# EAGLE design modules_board (EAGLE 9.6.2)
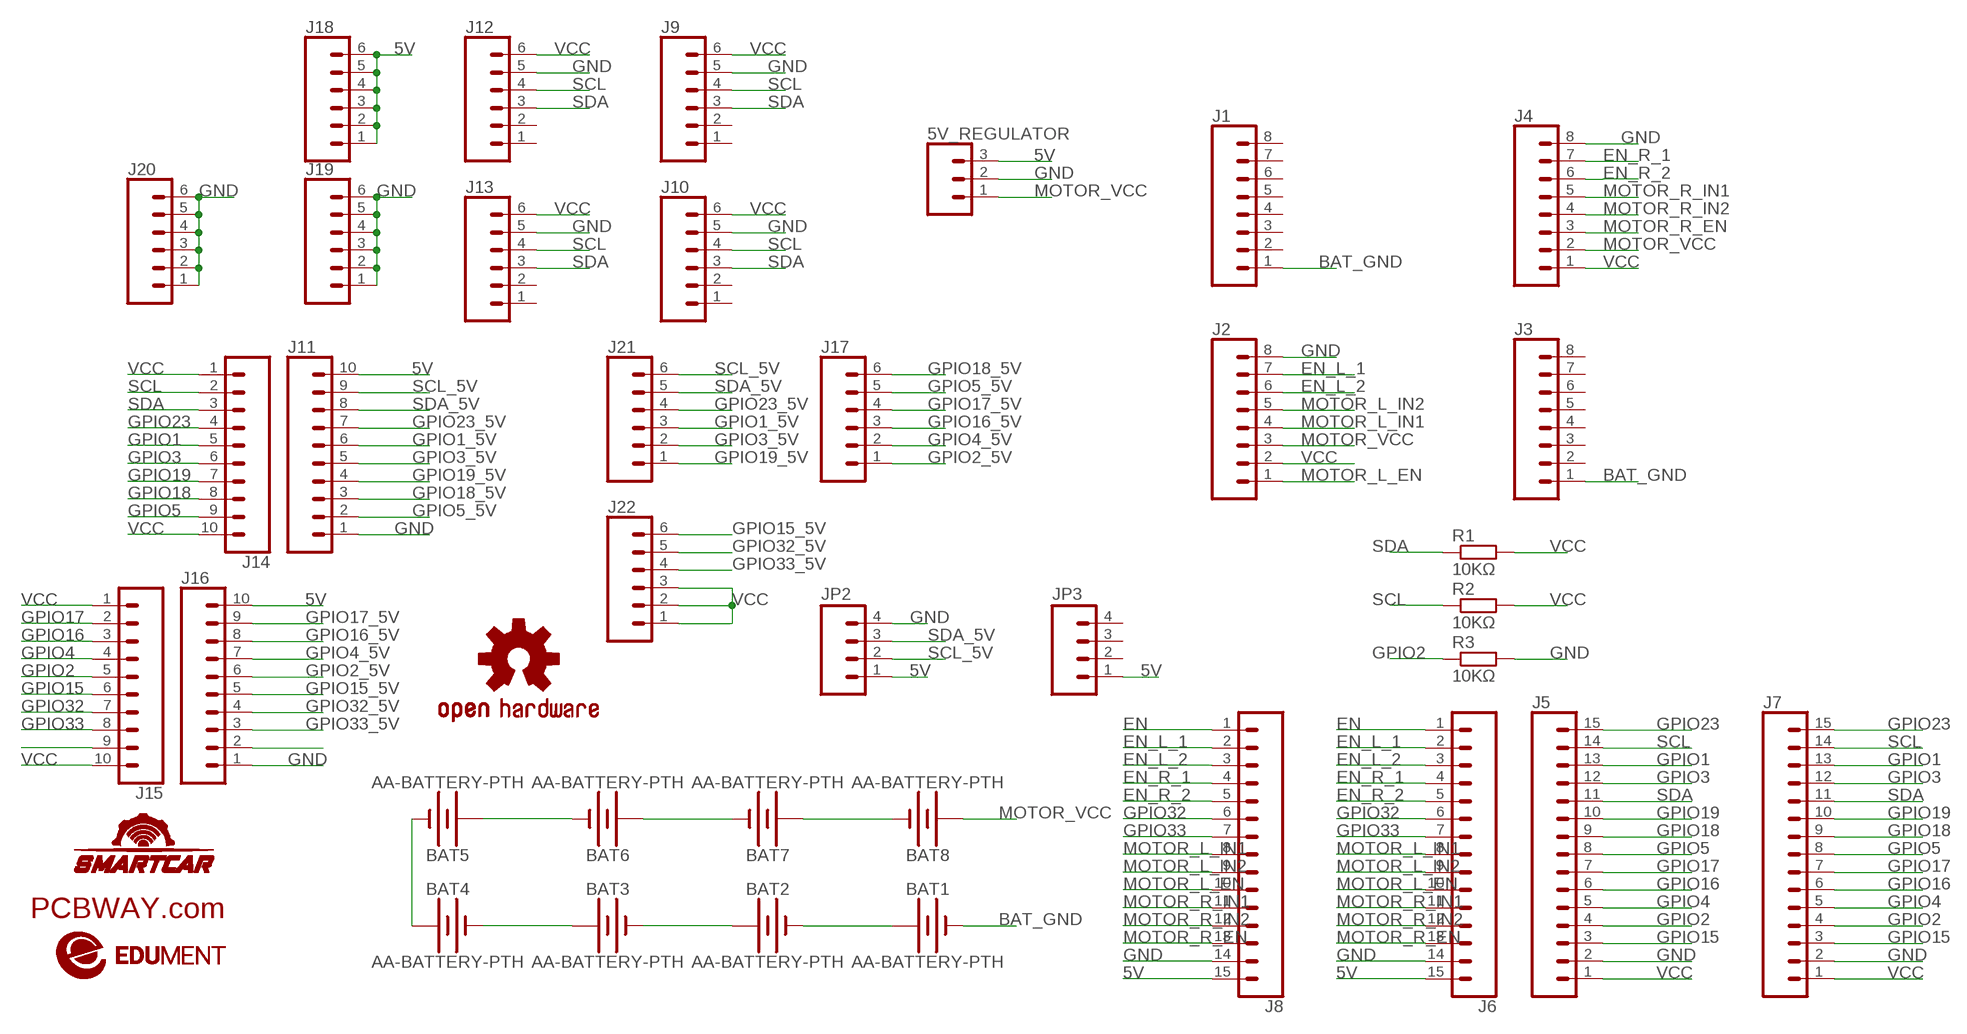
[diagram p0: schematic, sheet 1]

## Parts
5V_REGULATOR  CONN_03LOCK  [1X03_LOCK]
BAT1  AA-BATTERY-PTH  [AA-PCB-BATTERY]
BAT2  AA-BATTERY-PTH  [AA-PCB-BATTERY]
BAT3  AA-BATTERY-PTH  [AA-PCB-BATTERY]
BAT4  AA-BATTERY-PTH  [AA-PCB-BATTERY]
BAT5  AA-BATTERY-PTH  [AA-PCB-BATTERY]
BAT6  AA-BATTERY-PTH  [AA-PCB-BATTERY]
BAT7  AA-BATTERY-PTH  [AA-PCB-BATTERY]
BAT8  AA-BATTERY-PTH  [AA-PCB-BATTERY]
J1  CONN_08NO_SILK_FEMALE_PTH  [1X08_NO_SILK]
J2  CONN_08NO_SILK_FEMALE_PTH  [1X08_NO_SILK]
J3  CONN_08NO_SILK_FEMALE_PTH  [1X08_NO_SILK]
J4  CONN_08NO_SILK_FEMALE_PTH  [1X08_NO_SILK]
J5  CONN_15LOCK_LONGPADS  [1X15_LOCK_LONGPADS]
J6  CONN_15LOCK_LONGPADS  [1X15_LOCK_LONGPADS]
J7  CONN_15LOCK_NO_SILK  [1X15_LOCK_NO_SILK]
J8  CONN_15LOCK_NO_SILK  [1X15_LOCK_NO_SILK]
J9  CONN_06LOCK  [1X06_LOCK]
J10  CONN_06LOCK  [1X06_LOCK]
J11  CONN_10"  [1X10]
J12  CONN_06LOCK  [1X06_LOCK]
J13  CONN_06LOCK  [1X06_LOCK]
J14  CONN_10"  [1X10]
J15  CONN_10"  [1X10]
J16  CONN_10"  [1X10]
J17  CONN_06LOCK  [1X06_LOCK]
J18  CONN_06LOCK  [1X06_LOCK]
J19  CONN_06LOCK  [1X06_LOCK]
J20  CONN_06LOCK  [1X06_LOCK]
J21  CONN_06LOCK  [1X06_LOCK]
J22  CONN_06LOCK  [1X06_LOCK]
JP2  M04NO_SILK_ALL_ROUND  [1X04_NO_SILK_ALL_ROUND]
JP3  M04NO_SILK_ALL_ROUND  [1X04_NO_SILK_ALL_ROUND]
LOGO1  OSHW-LOGOL  [OSHW-LOGO-L]
R1  10KΩ  R-EU_0207/12  [0207/12]
R2  10KΩ  R-EU_0207/12  [0207/12]
R3  10KΩ  R-EU_0207/12  [0207/12]
SMRTCR1  SMARTCAR_LOGOMEDIUM  [SMARTCAR_LOGO_MEDIUM]
U$1  PCBWAY_LOGO  [PCBWAY_LOGO]
U$2  EDUMENT_LOGOLARGE  [EDUMENT_LOGO_LARGE]

## Nets
5V: 5V_REGULATOR.3 J6.15 J8.15 J11.10 J16.10 J18.1 J18.2 J18.3 J18.4 J18.5 J18.6 JP2.1 JP3.1
BAT_GND: BAT1.NEG(-) J1.1 J3.1
EN: J6.1 J8.1
EN_L_1: J2.7 J6.2 J8.2
EN_L_2: J2.6 J6.3 J8.3
EN_R_1: J4.7 J6.4 J8.4
EN_R_2: J4.6 J6.5 J8.5
GND: 5V_REGULATOR.2 J2.8 J4.8 J5.2 J6.14 J7.2 J8.14 J9.5 J10.5 J11.1 J12.5 J13.5 J16.1 J19.1 J19.2 J19.3 J19.4 J19.5 J19.6 J20.1 J20.2 J20.3 J20.4 J20.5 J20.6 JP2.4 R3.2
GPIO1: J5.13 J7.13 J14.5
GPIO1_5V: J11.6 J21.3
GPIO2: J5.4 J7.4 J15.5 R3.1
GPIO2_5V: J16.6 J17.1
GPIO3: J5.12 J7.12 J14.6
GPIO3_5V: J11.5 J21.2
GPIO4: J5.5 J7.5 J15.4
GPIO4_5V: J16.7 J17.2
GPIO5: J5.8 J7.8 J14.9
GPIO5_5V: J11.2 J17.5
GPIO15: J5.3 J7.3 J15.6
GPIO15_5V: J16.5 J22.6
GPIO16: J5.6 J7.6 J15.3
GPIO16_5V: J16.8 J17.3
GPIO17: J5.7 J7.7 J15.2
GPIO17_5V: J16.9 J17.4
GPIO18: J5.9 J7.9 J14.8
GPIO18_5V: J11.3 J17.6
GPIO19: J5.10 J7.10 J14.7
GPIO19_5V: J11.4 J21.1
GPIO23: J5.15 J7.15 J14.4
GPIO23_5V: J11.7 J21.4
GPIO32: J6.6 J8.6 J15.7
GPIO32_5V: J16.4 J22.5
GPIO33: J6.7 J8.7 J15.8
GPIO33_5V: J16.3 J22.4
MOTOR_L_EN: J2.1 J6.10 J8.10
MOTOR_L_IN1: J2.4 J6.8 J8.8
MOTOR_L_IN2: J2.5 J6.9 J8.9
MOTOR_R_EN: J4.3 J6.13 J8.13
MOTOR_R_IN1: J4.5 J6.11 J8.11
MOTOR_R_IN2: J4.4 J6.12 J8.12
MOTOR_VCC: 5V_REGULATOR.1 BAT8.POS(+) J2.3 J4.2
N$1: BAT2.POS(+) BAT3.NEG(-)
N$2: BAT1.POS(+) BAT2.NEG(-)
N$3: BAT3.POS(+) BAT4.NEG(-)
N$4: BAT4.POS(+) BAT5.NEG(-)
N$5: BAT5.POS(+) BAT6.NEG(-)
N$6: BAT6.POS(+) BAT7.NEG(-)
N$7: BAT7.POS(+) BAT8.NEG(-)
N$31: J15.9
N$32: J16.2
SCL: J5.14 J7.14 J9.4 J10.4 J12.4 J13.4 J14.2 R2.1
SCL_5V: J11.9 J21.6 JP2.2
SDA: J5.11 J7.11 J9.3 J10.3 J12.3 J13.3 J14.3 R1.1
SDA_5V: J11.8 J21.5 JP2.3
VCC: J2.2 J4.1 J5.1 J7.1 J9.6 J10.6 J12.6 J13.6 J14.1 J14.10 J15.1 J15.10 J22.1 J22.2 J22.3 R1.2 R2.2
Unconnected: J1.2 J1.3 J1.4 J1.5 J1.6 J1.7 J1.8 J3.2 J3.3 J3.4 J3.5 J3.6 J3.7 J3.8 J9.1 J9.2 J10.1 J10.2 J12.1 J12.2 J13.1 J13.2 JP3.2 JP3.3 JP3.4

## Library data of the parts
5V_REGULATOR = SparkFun-Connectors:CONN_03: Multi connection point. Often used as Generic Header-pin footprint for 0.1 inch spaced/style header connections On any of the 0.1 inch spaced packages, you can populate with these: Break Away Headers - Straight <https://www.sparkfun.com/products/116> (PRT-00116) Break Away Male Headers - Right Angle <https://www.sparkfun.com/products/553> (PRT-00553) Female Headers <https://www.sparkfun.com/products/115> (PRT-00115) Break Away Headers - Machine Pin <https://www.sparkfun.com/products/117> (PRT-00117) Break Away Female Headers - Swiss Machine Pin <https://www.sparkfun.com/products/743> (PRT-00743) Stackable Header - 3 Pin (Female, 0.1") <https://www.sparkfun.com/products/13875> (PRT-13875) For SCREWTERMINALS and SPRING TERMINALS visit here: Screw Terimnals on SparkFun.com <https://www.sparkfun.com/search/results?term=Screw+Terminals> (5mm/3.5mm/2.54mm spacing) This device is also useful as a general connection point to wire up your design to another part of your project. Our various solder wires solder well into these plated through hole pads. Hook-Up Wire - Assortment (Stranded, 22 AWG) <https://www.sparkfun.com/products/11375> (PRT-11375) Hook-Up Wire - Assortment (Solid Core, 22 AWG) <https://www.sparkfun.com/products/11367> (PRT-11367) View the entire wire category on our website here <https://www.sparkfun.com/categories/141> Special notes: Molex polarized connector foot print use with SKU : PRT-08232 with associated crimp pins and housings.
BAT1-BAT8 = my-parts:AA-BATTERY-PTH: Package for a single AA battery holder (PTH)
J1-J4 = SparkFun-Connectors:CONN_08: Multi connection point. Often used as Generic Header-pin footprint for 0.1 inch spaced/style header connections On any of the 0.1 inch spaced packages, you can populate with these: Break Away Headers - Straight <https://www.sparkfun.com/products/116> (PRT-00116) Break Away Male Headers - Right Angle <https://www.sparkfun.com/products/553> (PRT-00553) Female Headers <https://www.sparkfun.com/products/115> (PRT-00115) Break Away Headers - Machine Pin <https://www.sparkfun.com/products/117> (PRT-00117) Break Away Female Headers - Swiss Machine Pin <https://www.sparkfun.com/products/743> (PRT-00743) Arduino Stackable Header - 8 Pin <https://www.sparkfun.com/products/9279> (PRT-09279) For SCREWTERMINALS and SPRING TERMINALS visit here: Screw Terimnals on SparkFun.com <https://www.sparkfun.com/search/results?term=Screw+Terminals> (5mm/3.5mm/2.54mm spacing) This device is also useful as a general connection point to wire up your design to another part of your project. Our various solder wires solder well into these plated through hole pads. Hook-Up Wire - Assortment (Stranded, 22 AWG) <https://www.sparkfun.com/products/11375> (PRT-11375) Hook-Up Wire - Assortment (Solid Core, 22 AWG) <https://www.sparkfun.com/products/11367> (PRT-11367) View the entire wire category on our website here <https://www.sparkfun.com/categories/141> Special notes: Molex polarized connector foot print use with SKU : PRT-08231 with associated crimp pins and housings. 1MM SMD Version SKU: PRT-10208 NOTES ON THE VARIANTS LOCK and LOCK_LONGPADS... This footprint was designed to help hold the alignment of a through-hole component (i.e. 6-pin header) while soldering it into place. You may notice that each hole has been shifted either up or down by 0.005 of an inch from it's more standard position (which is a perfectly straight line). This slight alteration caused the pins (the squares in the middle) to touch the edges of the holes. Because they are alternating, it causes a "brace" to hold the component in place. 0.005 has proven to be the perfect amount of "off-center" position when using our standard breakaway headers. Although looks a little odd when you look at the bare footprint, once you have a header in there, the alteration is very hard to notice. Also,if you push a header all the way into place, it is covered up entirely on the bottom side.; PROD_ID: CONN-08438
J5-J8 = SparkFun-Connectors:CONN_15: Multi connection point. Often used as Generic Header-pin footprint for 0.1 inch spaced/style header connections On any of the 0.1 inch spaced packages, you can populate with these: Break Away Headers - Straight <https://www.sparkfun.com/products/116> (PRT-00116) Break Away Male Headers - Right Angle <https://www.sparkfun.com/products/553> (PRT-00553) Female Headers <https://www.sparkfun.com/products/115> (PRT-00115) Break Away Headers - Machine Pin <https://www.sparkfun.com/products/117> (PRT-00117) Break Away Female Headers - Swiss Machine Pin <https://www.sparkfun.com/products/743> (PRT-00743) For SCREWTERMINALS and SPRING TERMINALS visit here: Screw Terimnals on SparkFun.com <https://www.sparkfun.com/search/results?term=Screw+Terminals> (5mm/3.5mm/2.54mm spacing) This device is also useful as a general connection point to wire up your design to another part of your project. Our various solder wires solder well into these plated through hole pads. Hook-Up Wire - Assortment (Stranded, 22 AWG) <https://www.sparkfun.com/products/11375> (PRT-11375) Hook-Up Wire - Assortment (Solid Core, 22 AWG) <https://www.sparkfun.com/products/11367> (PRT-11367) View the entire wire category on our website here <https://www.sparkfun.com/categories/141> Special notes: Molex polarized connector foot print use with SKU : PRT-08231 with associated crimp pins and housings. 1MM SMD Version SKU: PRT-10208 NOTES ON THE VARIANTS LOCK and LOCK_LONGPADS... This footprint was designed to help hold the alignment of a through-hole component (i.e. 6-pin header) while soldering it into place. You may notice that each hole has been shifted either up or down by 0.005 of an inch from it's more standard position (which is a perfectly straight line). This slight alteration caused the pins (the squares in the middle) to touch the edges of the holes. Because they are alternating, it causes a "brace" to hold the component in place. 0.005 has proven to be the perfect amount of "off-center" position when using our standard breakaway headers. Although looks a little odd when you look at the bare footprint, once you have a header in there, the alteration is very hard to notice. Also,if you push a header all the way into place, it is covered up entirely on the bottom side.
J9 J10 J12 J13 J17-J22 = SparkFun-Connectors:CONN_06: Multi connection point. Often used as Generic Header-pin footprint for 0.1 inch spaced/style header connections On any of the 0.1 inch spaced packages, you can populate with these: Break Away Headers - Straight <https://www.sparkfun.com/products/116> (PRT-00116) Break Away Male Headers - Right Angle <https://www.sparkfun.com/products/553> (PRT-00553) Female Headers <https://www.sparkfun.com/products/115> (PRT-00115) Break Away Headers - Machine Pin <https://www.sparkfun.com/products/117> (PRT-00117) Break Away Female Headers - Swiss Machine Pin <https://www.sparkfun.com/products/743> (PRT-00743) Arduino Stackable Header - 6 Pin <https://www.sparkfun.com/products/9280> (PRT-09280) For SCREWTERMINALS and SPRING TERMINALS visit here: Screw Terimnals on SparkFun.com <https://www.sparkfun.com/search/results?term=Screw+Terminals> (5mm/3.5mm/2.54mm spacing) This device is also useful as a general connection point to wire up your design to another part of your project. Our various solder wires solder well into these plated through hole pads. Hook-Up Wire - Assortment (Stranded, 22 AWG) <https://www.sparkfun.com/products/11375> (PRT-11375) Hook-Up Wire - Assortment (Solid Core, 22 AWG) <https://www.sparkfun.com/products/11367> (PRT-11367) View the entire wire category on our website here <https://www.sparkfun.com/categories/141>
J11 J14-J16 = SparkFun-Connectors:CONN_10: Multi connection point. Often used as Generic Header-pin footprint for 0.1 inch spaced/style header connections On any of the 0.1 inch spaced packages, you can populate with these: Break Away Headers - Straight <https://www.sparkfun.com/products/116> (PRT-00116) Break Away Male Headers - Right Angle <https://www.sparkfun.com/products/553> (PRT-00553) Female Headers <https://www.sparkfun.com/products/115> (PRT-00115) Break Away Headers - Machine Pin <https://www.sparkfun.com/products/117> (PRT-00117) Break Away Female Headers - Swiss Machine Pin <https://www.sparkfun.com/products/743> (PRT-00743) Arduino Stackable Header - 10 Pin <https://www.sparkfun.com/products/11376> (PRT-11376) For SCREWTERMINALS and SPRING TERMINALS visit here: Screw Terimnals on SparkFun.com <https://www.sparkfun.com/search/results?term=Screw+Terminals> (5mm/3.5mm/2.54mm spacing) This device is also useful as a general connection point to wire up your design to another part of your project. Our various solder wires solder well into these plated through hole pads. Hook-Up Wire - Assortment (Stranded, 22 AWG) <https://www.sparkfun.com/products/11375> (PRT-11375) Hook-Up Wire - Assortment (Solid Core, 22 AWG) <https://www.sparkfun.com/products/11367> (PRT-11367) View the entire wire category on our website here <https://www.sparkfun.com/categories/141> Special notes: Molex polarized connector foot print use with SKU : PRT-08231 with associated crimp pins and housings. 1MM SMD Version SKU: PRT-10208 NOTES ON THE VARIANTS LOCK and LOCK_LONGPADS... This footprint was designed to help hold the alignment of a through-hole component (i.e. 6-pin header) while soldering it into place. You may notice that each hole has been shifted either up or down by 0.005 of an inch from it's more standard position (which is a perfectly straight line). This slight alteration caused the pins (the squares in the middle) to touch the edges of the holes. Because they are alternating, it causes a "brace" to hold the component in place. 0.005 has proven to be the perfect amount of "off-center" position when using our standard breakaway headers. Although looks a little odd when you look at the bare footprint, once you have a header in there, the alteration is very hard to notice. Also,if you push a header all the way into place, it is covered up entirely on the bottom side.; PROD_ID: CONN-11563
JP2 JP3 = SparkFun-Connectors:M04: Header 4 Standard 4-pin 0.1" header. Use with straight break away headers (SKU : PRT-00116), right angle break away headers (PRT-00553), swiss pins (PRT-00743), machine pins (PRT-00117), and female headers (PRT-00115). Molex polarized connector foot print use with SKU : PRT-08231 with associated crimp pins and housings. 1MM SMD Version SKU: PRT-10208
LOGO1 = SparkFun-Aesthetics:OSHW-LOGO: Open-Source Hardware (OSHW) Logo This logo indicates the piece of hardware it is found on incorporates a OSHW license and/or adheres to the definition of open source hardware found here: http://freedomdefined.org/OSHW
R1-R3 = rcl:R-EU_: RESISTOR, European symbol; SPICEPREFIX: R
SMRTCR1 = my_parts:SMARTCAR_LOGO: Smartcar logo on the silk layer
U$1 = my_parts:PCBWAY_LOGO
U$2 = my_parts:EDUMENT_LOGO

## Net classes
0 default: width 0.152 mm, drill 0.305 mm, clearance 0.152 mm

## Board
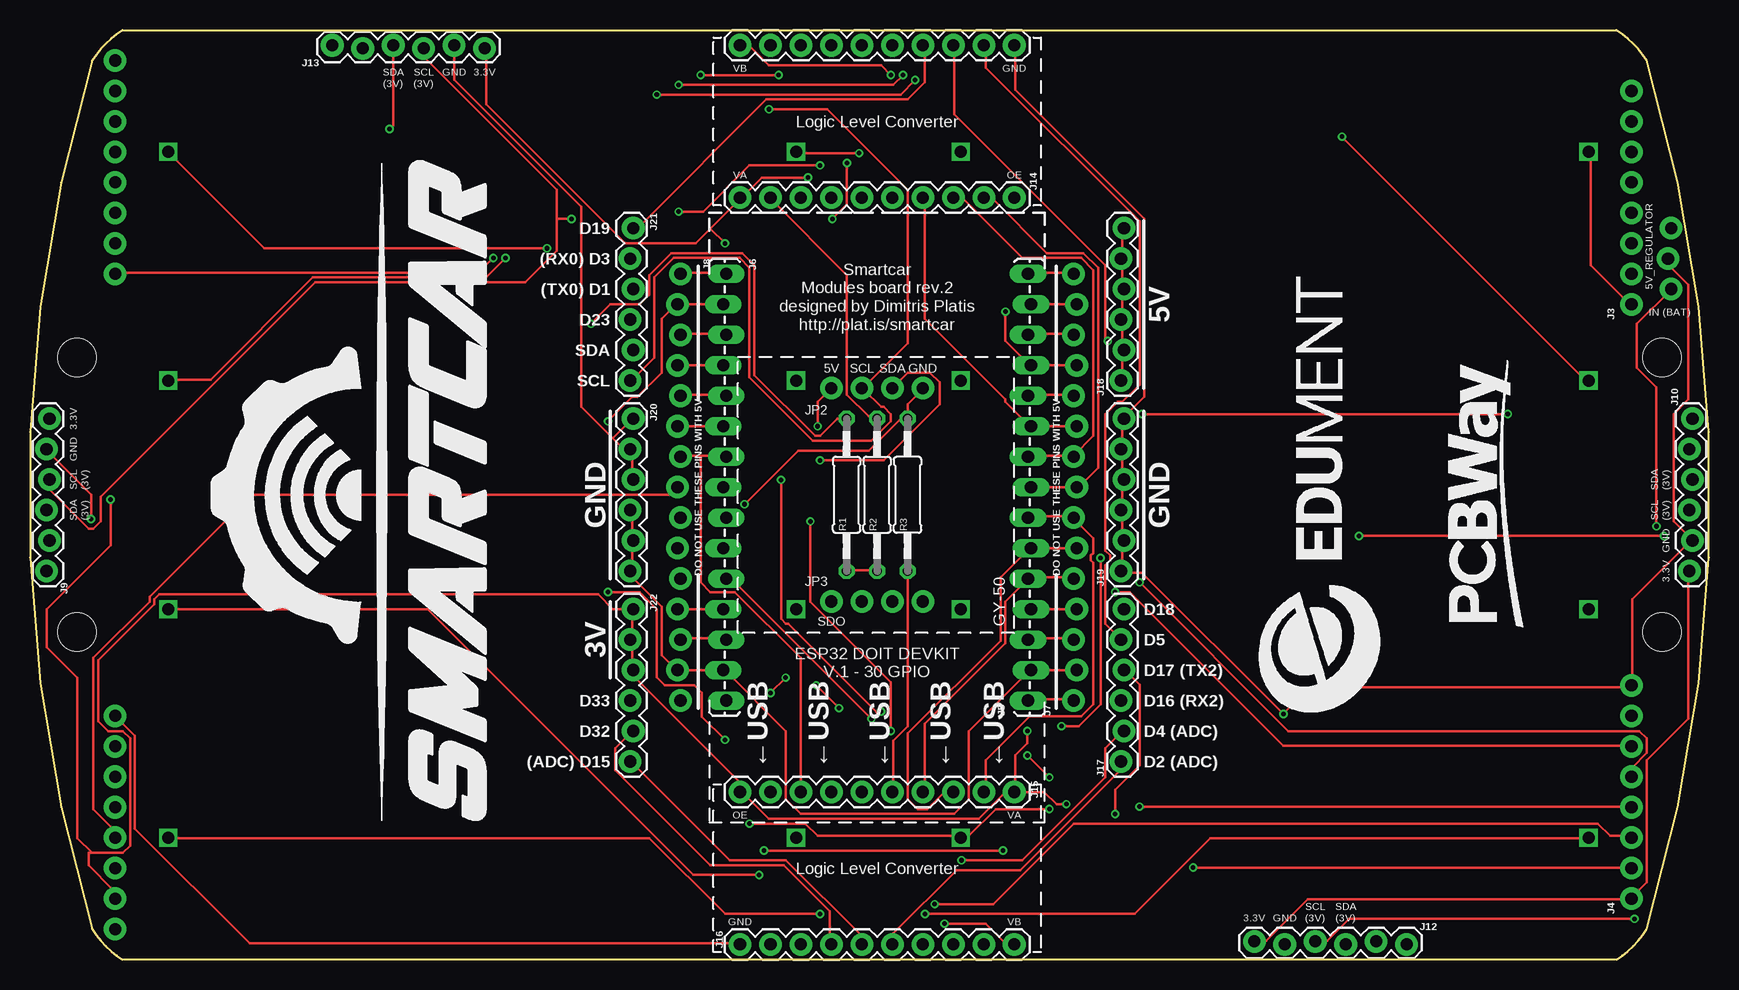
[diagram p1: board, top side]
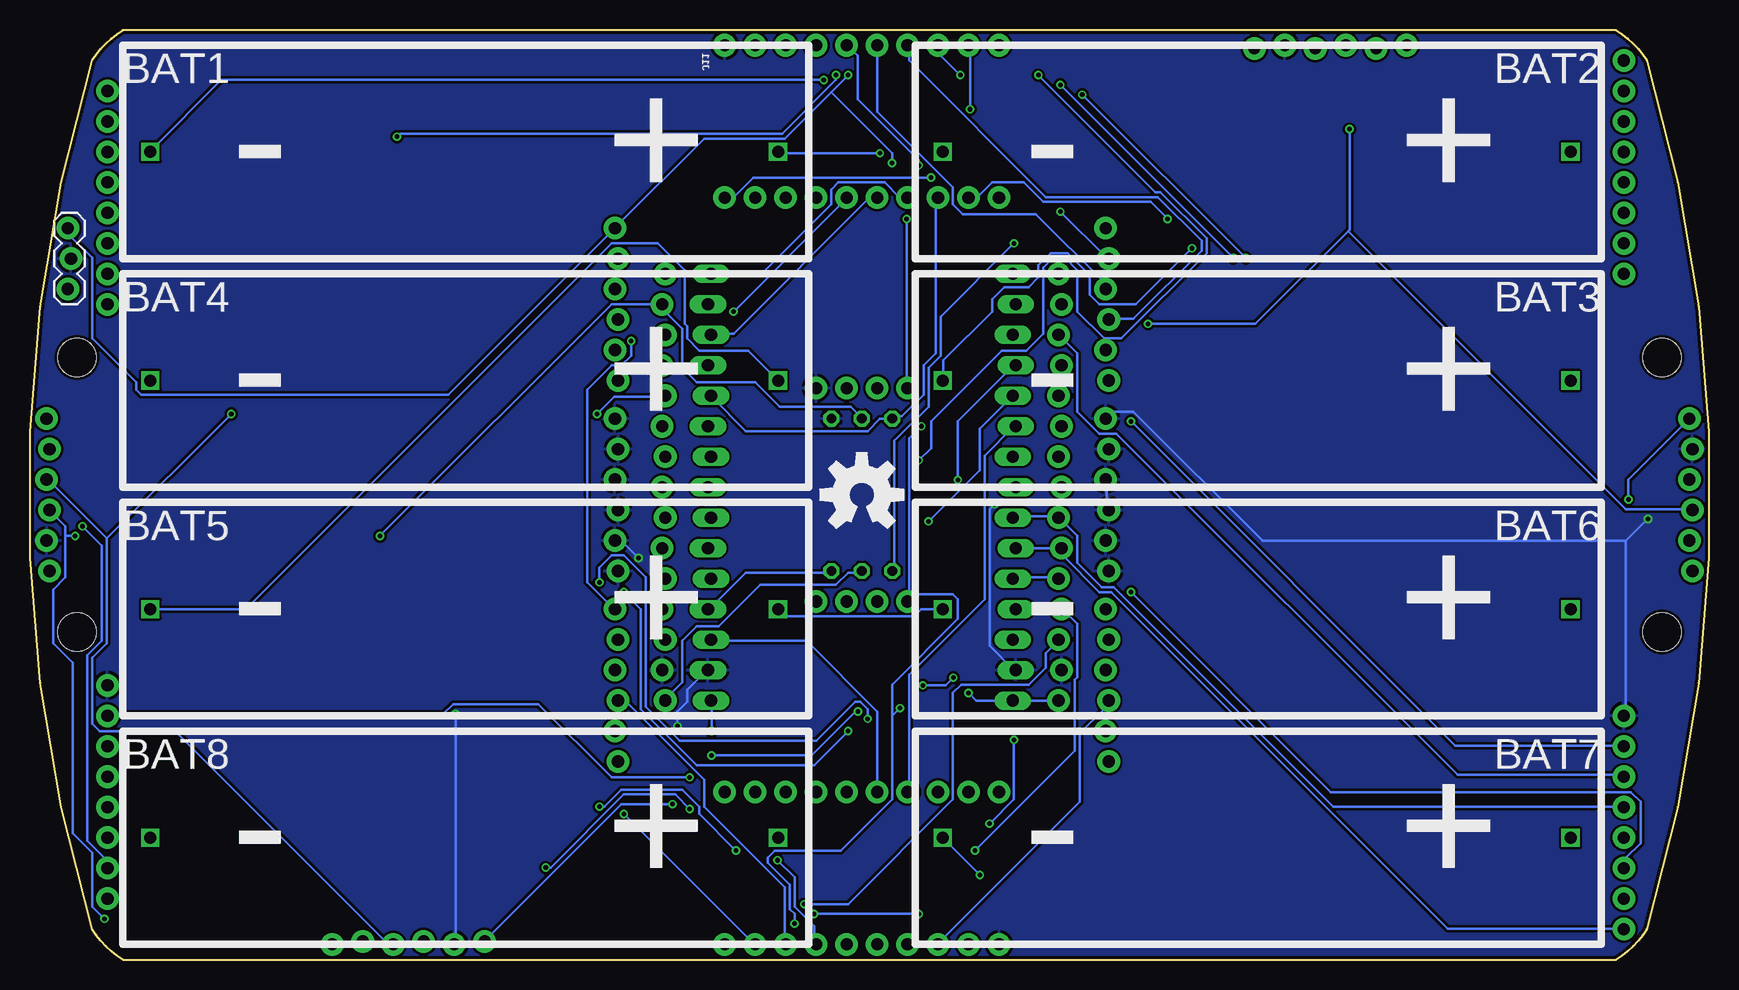
[diagram p2: board, bottom side, seen from below]

Size 139.91 x 77.47 mm. Coordinates in mm from the lower left corner, seen from the top.
Outline: 5.19,74.93 arc33 5.19,2.54 arc25 7.73,0 132.19,0 arc25 134.73,2.54 arc33 134.73,74.93 arc25 132.19,77.47 7.73,77.47 arc25 5.19,74.93
Copper layers (1*16): Top 0.035mm / dielectric 1.5mm / Bottom 0.035mm
Design rules "SeeedStudio_2layer_DRU_edited *": minimum track width 8mil, minimum drill 15mil, track to track 8mil, track to pad 8mil, pad to pad 8mil, via to via 8mil, smd to smd 0mil, copper to edge 10mil, drill to drill 12mil, minimum pad ring 10mil, minimum via ring 6mil, stop-mask expansion 2mil, vias tented up to drill 100mil, thermal gap 10mil
Holes 3.2 mm at 3.92,50.16 3.92,27.31 136,50.16 136,27.31

### Footprints (pad centres in the part's own frame; a part is rotated, then mirrored left to right if it is on the bottom)
1X03_LOCK = drill 1.016 pad 1.88: 1 0,0.127; 2 2.54,-0.127; 3 5.08,0.127
AA-PCB-BATTERY = drill 1 square: NEG -52.3,0; POS 0,0
1X08_NO_SILK = drill 1.016 pad 1.88: 1 0,0; 2 2.54,0; 3 5.08,0; 4 7.62,0; 5 10.16,0; 6 12.7,0; 7 15.24,0; 8 17.78,0
1X15_LOCK_LONGPADS = drill 1.016 long: 1 0,0.127; 2 2.54,-0.127; 3 5.08,0.127; 4 7.62,-0.127; 5 10.16,0.127; 6 12.7,-0.127; 7 15.24,0.127; 8 17.78,-0.127; 9 20.32,0.127; 10 22.86,-0.127; 11 25.4,0.127; 12 27.94,-0.127; 13 30.48,0.127; 14 33.02,-0.127; 15 35.56,0.127
1X15_LOCK_NO_SILK = drill 1.016 pad 1.88: 1 0,0.127; 2 2.54,-0.127; 3 5.08,0.127; 4 7.62,-0.127; 5 10.16,0.127; 6 12.7,-0.127; 7 15.24,0.127; 8 17.78,-0.127; 9 20.32,0.127; 10 22.86,-0.127; 11 25.4,0.127; 12 27.94,-0.127; 13 30.48,0.127; 14 33.02,-0.127; 15 35.56,0.127
1X06_LOCK = drill 1.016 pad 1.88: 1 0,0; 2 2.54,-0.254; 3 5.08,0; 4 7.62,-0.254; 5 10.16,0; 6 12.7,-0.254
1X10 = drill 1.016 pad 1.88: 1 0,0; 2 2.54,0; 3 5.08,0; 4 7.62,0; 5 10.16,0; 6 12.7,0; 7 15.24,0; 8 17.78,0; 9 20.32,0; 10 22.86,0
1X04_NO_SILK_ALL_ROUND = drill 1.016 pad 1.88: 1 0,0; 2 2.54,0; 3 5.08,0; 4 7.62,0
0207/12 = drill 0.813 octagon: 1 -6.35,0; 2 6.35,0

### Placement (x,y rotation side)
5V_REGULATOR  136.63,55.88 90 bottom
BAT1  77.58,67.31 0 bottom
BAT2  11.54,67.31 0 bottom
BAT3  11.54,48.26 0 bottom
BAT4  77.58,48.26 0 bottom
BAT5  77.58,29.21 0 bottom
BAT6  11.54,29.21 0 bottom
BAT7  11.54,10.16 0 bottom
BAT8  77.58,10.16 0 bottom
J1  7.09,57.15 90 top
J2  7.09,2.54 90 top
J3  133.46,54.61 90 top
J4  133.46,5.08 90 top
J5  83.29,21.59 90 top
J6  57.89,57.15 270 top
J7  87.1,21.59 90 top
J8  54.08,57.15 270 top
J9  1.38,32.39 90 top
J10  138.54,45.08 270 top
J11  82.02,76.2 180 top
J12  114.72,1.27 180 top
J13  25.19,76.2 0 top
J14  59.16,63.5 0 top
J15  82.02,13.97 180 top
J16  59.16,1.27 0 top
J17  90.91,16.51 90 top
J18  90.91,48.26 90 top
J19  90.91,32.39 90 top
J20  50.27,45.08 270 top
J21  50.27,60.96 270 top
J22  50.27,29.21 270 top
JP2  66.78,47.62 0 top
JP3  66.78,29.85 0 top
LOGO1  70.59,38.73 0 bottom
R1  68.05,38.73 270 top
R2  70.59,38.73 270 top
R3  73.13,38.73 90 top
SMRTCR1  29.32,38.73 90 top
U$1  120.12,38.73 90 top
U$2  112.5,20.64 90 top

### Tracks (layer width: path | path; a pad name or v marks a point on that pad's centre or on a via)
5V  (via drill 0.38)
  Top 0.203: v65.64,44.45 65.64,46.48 JP2.1 | v76.2,3 79.66,3 81.28,1.37 81.89,1.37 J16.10 | J18.1 91.04,48.31 91.04,50.75 J18.2 91.04,50.95 91.04,53.19 J18.3 91.04,53.39 91.04,55.83 J18.4 91.04,56.03 91.04,58.27 J18.5 91.04,58.47 91.04,60.91 J18.6 | v71.73,73.71 70.92,74.52 61.57,74.52 59.95,76.15 59.34,76.15 J11.10 | v66.86,61.72 68.08,62.94 v68.08,66.4 | v67.42,20.96 v65.51,22.86 | v62.97,23.5 v61.7,22.22
  Bottom 0.203: 66.65,30.43 66.65,43.43 v65.64,44.45 | 66.65,30.43 66.65,30.02 JP3.1 66.65,30.43 | v76.2,3 76.2,3.81 76.61,4.22 76.61,6.25 78.44,8.08 78.44,8.48 77.83,9.09 72.34,9.09 68.08,13.36 68.08,20.32 | 68.08,20.32 68.08,22.91 62.59,28.4 62.59,30.02 63,30.43 66.65,30.43 | 5V_REGULATOR.3 136.76,60.5 134.73,58.47 134.73,51.77 131.07,48.11 131.07,47.5 130.66,47.09 105.06,47.09 91.24,60.91 J18.6 91.04,61.11 83.72,68.43 77.02,68.43 73.16,72.29 | 73.16,72.29 v71.73,73.71 | v66.86,61.72 66.86,47.7 JP2.1 | v68.08,66.4 68.08,67.21 73.16,72.29 | 68.08,20.32 68.05,20.32 v67.42,20.96 | v65.51,22.86 63.61,22.86 v62.97,23.5 | v61.7,22.22 61.07,21.59 J6.15 J8.15
BAT_GND  (via drill 0.38)
  Top 0.203: BAT1.NEG 130.05,67.21 130.05,57.86 133.3,54.61 J3.1 | v38.61,58.47 37.39,57.25 7.12,57.25 J1.1 | v52.23,72.08 72.55,72.08 v73.77,73.3
  Bottom 0.203: v52.23,72.08 v38.61,58.47 | v73.77,73.3 123.96,73.3 129.85,67.41 BAT1.NEG
EN
  Top 0.203: J6.1 57.92,57.25 54.26,57.25 J8.1
EN_L_1  (via drill 0.38)
  Top 0.203: J6.2 J8.2 53.85,54.61 52.63,53.39 52.63,48.92 50.6,46.89 50.2,46.89 v48.16,44.86
  Bottom 0.203: v48.16,44.86 21.14,17.83 7.12,17.83 J2.7
EN_L_2
  Top 0.203: J6.3 57.92,52.17 54.26,52.17 J8.3
  Bottom 0.203: J2.6 7.12,15.39 20.93,15.39 49.38,43.84 50.8,43.84 52.63,45.67 52.63,50.55 54.06,51.97 J8.3
EN_R_1  (via drill 0.38)
  Top 0.203: J8.4 J6.4 | v83.11,17.02 v84.94,15.19 | v70.92,20.68 70.52,20.68 63.2,27.99 63,27.99 62.59,28.4 v62.59,39.98
  Bottom 0.203: v84.94,15.19 91.44,15.19 97.54,21.29 104.65,21.29 105.47,20.47 133.3,20.47 J4.7 | v83.11,17.02 74.78,17.02 71.12,20.68 v70.92,20.68 | v62.59,39.98 62.59,44.86 57.92,49.53 J6.4
EN_R_2  (via drill 0.38)
  Top 0.203: J6.5 57.92,47.09 54.26,47.09 J8.5 | v90.43,30.63 91.65,30.63 104.45,17.83 133.3,17.83 J4.6 | v71.73,19.05 71.73,23.11 65.03,29.82 v65.03,36.53
  Bottom 0.203: v90.43,30.63 89.01,29.21 89.01,20.88 84.33,16.21 74.58,16.21 v71.73,19.05 | v65.03,36.53 60.76,40.79 60.76,44.25 J6.5
GND  (via drill 0.38)
  Top 0.203: J11.1 82.1,76.15 82.1,72.49 92.87,61.72 92.87,46.89 91.24,45.26 J19.6 91.04,45.06 91.04,42.62 J19.5 91.04,42.42 91.04,40.18 J19.4 91.04,39.98 91.04,37.54 J19.3 91.04,37.34 91.04,35.1 J19.2 91.04,34.9 91.04,32.46 J19.1 91.04,32.26 92.66,32.26 v104.45,20.47 106.68,22.71 133.3,22.71 J4.8 133.51,22.91 133.51,30.02 138.38,34.9 J10.5 138.38,35.1 136.96,36.53 136.96,45.47 138.18,46.69 138.18,56.24 136.56,57.86 136.56,58.27 5V_REGULATOR.2 | v5.08,36.73 5.08,38.76 1.43,42.42 J9.5 | J16.1 59.14,1.37 18.29,1.37 8.74,10.92 8.74,18.64 7.12,20.27 J2.8 | J20.4 50.2,37.34 50.2,35.1 J20.5 50.2,34.9 50.2,32.46 J20.6 50.2,32.26 50.2,31.85 52.63,29.41 52.63,25.35 53.85,24.13 J8.14 J6.14 57.92,24.13 63,19.05 63,13.36 64.22,12.14 77.02,12.14 78.24,13.36 78.24,19.05 83.32,24.13 J5.2 J7.2 | J20.3 50.2,40.18 50.2,42.42 J20.2 49.99,42.62 49.38,42.62 48.57,43.43 | 48.57,43.43 45.93,46.08 45.93,62.74 35.36,73.3 35.36,76.15 J13.5 | 48.57,43.43 50.2,45.06 J20.1 | JP2.4 74.38,47.5 73.16,46.28 73.16,45.26 R3.2 72.95,45.06 72.55,45.06 69.91,42.42 64.01,42.42 v59.54,37.95 | v89.21,33.48 89.21,21.29 87.38,19.46 v85.96,19.46
  Bottom 0.203: v104.45,20.47 104.45,1.37 J12.5 | 6.91,34.9 6.91,20.47 J2.8 | v5.08,36.73 6.91,34.9 | J20.4 50.2,37.54 50.2,39.98 J20.3 | v59.54,37.95 59.95,37.54 59.95,26.16 57.92,24.13 J6.14 | 6.91,34.9 37.19,34.9 47.96,45.67 49.79,45.67 50.2,45.26 J20.1 | v89.21,33.48 90.63,34.9 91.04,34.9 J19.2 | v85.96,19.46 85.96,20.68 85.15,21.49 85.15,22.5 83.52,24.13 J5.2
  pour Bottom: -4.97,83.19 -4.97,-7.62 144.25,-7.62 144.25,83.19
GPIO1
  Top 0.203: J5.13 83.32,52.17 86.97,52.17 J7.13
  Bottom 0.203: J14.5 69.5,63.35 70.11,63.35 81.28,52.17 83.11,52.17 J5.13
GPIO1_5V
  Bottom 0.203: J21.3 50.4,56.03 50.4,56.44 56.09,62.13 62.18,62.13 63,62.94 63,64.36 69.3,70.66 69.3,76.15 J11.6
GPIO2
  Top 0.203: J15.5 71.94,13.97 71.94,18.24 73.16,19.46 73.16,32.26 R3.1 | J5.4 J7.4
  Bottom 0.203: R3.1 73.16,32.26 80.27,32.26 83.32,29.21 J5.4
GPIO2_5V
  Top 0.203: J16.6 71.94,1.37 71.94,2.18 77.22,7.47 82.5,7.47 90.84,15.8 90.84,16.41 J17.1
GPIO3  (via drill 0.38)
  Top 0.203: J7.12 J5.12 83.32,49.53 81.28,51.56 v81.28,54
  Bottom 0.203: v81.28,54 71.94,63.35 J14.6
GPIO3_5V  (via drill 0.38)
  Top 0.203: v54.06,62.33 56.09,62.33 59.95,66.19 v65.84,66.19
  Bottom 0.203: v54.06,62.33 50.2,58.47 J21.2 | v65.84,66.19 65.84,66.6 70.92,71.68 70.92,75.34 71.73,76.15 J11.5
GPIO4
  Top 0.203: J7.5 86.97,31.85 83.32,31.85 J5.5 83.11,31.65 81.28,29.82 81.28,26.36 74.58,19.66 74.58,13.97 J15.4
GPIO4_5V  (via drill 0.38)
  Top 0.203: v77.63,8.28 82.71,8.28 89.62,15.19 89.62,17.63 91.04,19.05 J17.2
  Bottom 0.203: v77.63,8.28 76.2,6.86 76.2,4.42 74.58,2.79 74.58,1.37 J16.7
GPIO5
  Top 0.203: J5.8 J7.8 87.38,39.37 89.01,41 89.01,57.66 87.79,58.88 84.74,58.88 80.27,63.35 79.66,63.35 J14.9
GPIO5_5V
  Top 0.203: J11.2 79.66,76.15 79.66,74.32 92.46,61.52 92.46,47.9 91.04,46.48 90.63,46.48 89.62,45.47 89.62,34.09 90.02,33.68 90.02,33.27 89.62,32.87 89.62,27.99 90.84,26.77 J17.5
GPIO15
  Top 0.203: J5.3 83.32,26.77 86.97,26.77 J7.3
  Bottom 0.203: J15.6 69.3,13.97 69.3,20.68 75.19,26.57 83.11,26.57 J5.3
GPIO15_5V
  Top 0.203: J16.5 69.3,1.37 69.3,1.98 63,8.28 58.32,8.28 50.2,16.41 J22.6
GPIO16
  Top 0.203: J7.6 J5.6 83.32,34.29 80.88,31.85 80.88,26.57 73.16,18.85 73.16,13.36 73.97,12.55 74.78,12.55 76.2,13.97 J15.3
GPIO16_5V
  Bottom 0.203: J16.8 77.02,1.37 77.02,6.05 83.72,12.75 83.72,14.99 90.23,21.49 90.84,21.49 J17.3
GPIO17
  Top 0.203: J5.7 83.32,36.93 86.97,36.93 J7.7 86.97,36.73 88.6,35.1 88.6,33.88 88.4,33.68 88.4,33.27 88.6,33.07 88.6,21.29 87.58,20.27 83.32,20.27 79.66,16.61 79.66,13.97 J15.2
GPIO17_5V  (via drill 0.38)
  Top 0.203: v90.43,12.14 90.43,14.17 92.46,16.21 92.46,22.91 91.24,24.13 J17.4
  Bottom 0.203: v90.43,12.14 79.66,1.37 J16.9
GPIO18
  Top 0.203: 86.97,42.01 83.32,42.01 J5.9 | 86.97,42.01 88.6,43.64 88.6,57.45 87.58,58.47 82.71,58.47 77.83,63.35 77.02,63.35 J14.8 | 86.97,42.01 J7.9
GPIO18_5V  (via drill 0.38)
  Top 0.203: v89.82,51.56 89.62,51.77 89.62,57.86 77.02,70.46 77.02,76.15 J11.3
  Bottom 0.203: v89.82,51.56 89.82,50.34 90.63,49.53 91.44,49.53 93.48,47.5 93.48,31.44 91.24,29.21 J17.6
GPIO19
  Top 0.203: J7.10 J5.10 83.32,44.45 81.28,46.48 81.28,46.69 74.58,53.39 74.58,63.35 J14.7
GPIO19_5V
  Top 0.203: J21.1 50.4,61.11 50.8,61.11 61.37,71.68 73.16,71.68 74.58,73.1 74.58,76.15 J11.4
GPIO23
  Top 0.203: J5.15 83.32,57.25 86.97,57.25 J7.15
  Bottom 0.203: J14.4 66.86,63.55 67.47,63.55 68.69,64.77 72.55,64.77 73.16,64.16 73.16,62.94 78.85,57.25 83.11,57.25 J5.15
GPIO23_5V
  Bottom 0.203: J21.4 49.99,53.39 47.96,53.39 42.27,59.08 42.27,59.89 45.93,63.55 55.28,63.55 66.65,74.93 66.65,76.15 J11.7
GPIO32
  Top 0.203: J8.6 J6.6
  Bottom 0.203: J15.7 66.65,13.97 66.65,23.72 60.36,30.02 60.36,42.01 57.92,44.45 J6.6
GPIO32_5V
  Top 0.203: J16.4 66.65,1.37 66.65,4.01 62.79,7.87 56.7,7.87 48.77,15.8 48.77,17.63 50.2,19.05 J22.5
GPIO33
  Top 0.203: 55.88,42.01 54.26,42.01 J8.7 | 55.88,42.01 57.92,42.01 J6.7 | 55.88,42.01 55.88,31.44 56.7,30.63 58.73,30.63 64.22,25.15 64.22,13.97 J15.8
GPIO33_5V
  Bottom 0.203: J22.4 50.2,21.49 50.2,21.08 52.43,18.85 52.43,13.16 64.22,1.37 J16.3
MOTOR_L_EN
  Bottom 0.203: J6.10 J8.10 53.85,34.29 53.85,33.68 50.8,30.63 49.79,30.63 21.75,2.59 7.12,2.59 J2.1
MOTOR_L_IN1
  Top 0.203: J2.4 6.91,10.31 6.91,10.92 5.29,12.55 5.29,25.15 9.96,29.82 9.96,30.23 18.5,38.76 53.24,38.76 53.85,39.37 J8.8
  Bottom 0.203: J8.8 J6.8
MOTOR_L_IN2
  Bottom 0.203: J6.9 57.92,36.93 54.26,36.93 J8.9 54.06,36.73 52.63,35.31 52.63,33.07 50.6,31.04 49.59,31.04 31.3,12.75 7.12,12.75 J2.5
MOTOR_R_EN  (via drill 0.38)
  Top 0.203: J6.13 57.92,26.77 54.26,26.77 J8.13 | v75.39,4.62 80.27,4.62 86.97,11.33 130.66,11.33 131.68,10.31 133.3,10.31 J4.3
  Bottom 0.203: v75.39,4.62 71.73,4.62 63,13.36 63,22.22 62.31,22.91 56.7,22.91 55.28,24.33 55.28,25.55 54.26,26.57 J8.13
MOTOR_R_IN1  (via drill 0.38)
  Top 0.203: v92.46,31.44 104.86,19.05 134.12,19.05 134.73,18.44 134.73,17.22 133.51,16 133.51,15.39 J4.5 | v70.11,20.07 58.53,31.65 58.12,31.65 J6.11
  Bottom 0.203: J6.11 57.92,31.85 54.26,31.85 J8.11 | v92.46,31.44 92.46,32.66 91.44,33.68 90.43,33.68 88.6,31.85 88.6,21.08 85.76,18.24 74.38,18.24 71.12,21.49 70.72,21.49 70.11,20.88 v70.11,20.07
MOTOR_R_IN2  (via drill 0.38)
  Top 0.203: J8.12 J6.12 | v92.46,12.75 133.3,12.75 J4.4 | v61.17,9.09 v81.08,9.09
  Bottom 0.203: v92.46,12.75 92.05,12.75 90.63,14.17 85.55,14.17 84.13,12.75 84.13,12.14 v81.08,9.09 | v61.17,9.09 52.84,17.42 52.84,23.32 52.63,23.52 52.63,27.99 53.85,29.21 J8.12
MOTOR_VCC  (via drill 0.38)
  Top 0.203: v135.54,36.12 135.54,47.7 133.91,49.33 133.91,52.98 136.76,55.83 5V_REGULATOR.1 | v59.95,11.33 64.62,11.33 65.64,10.31 77.42,10.31 BAT8.POS 77.63,10.31 78.24,10.31 80.47,12.55 v84.94,12.55 | v48.16,30.63 50.8,30.63 52.23,29.21 52.23,23.52 52.89,22.86 55.35,22.86 55.99,22.22 55.99,20.24 v57.92,18.31 | v96.93,7.67 133.3,7.67 J4.2
  Bottom 0.203: v135.54,36.12 133.91,34.49 133.91,26.57 135.13,25.35 135.13,9.91 133.51,8.28 133.51,7.67 J4.2 | v59.95,11.33 57.92,13.36 v57.92,18.31 | v48.16,30.63 31.5,13.97 6.51,13.97 5.69,13.16 5.69,9.7 6.91,8.48 6.91,7.67 J2.3 | v96.93,7.67 96.52,7.67 90.43,13.77 86.16,13.77 v84.94,12.55
N$1  (via drill 0.38)
  Top 0.203: v43.08,59.28 19.51,59.28 11.59,67.21 BAT2.POS
  Bottom 0.203: v43.08,59.28 47.76,54.61 50.8,54.61 51.62,55.42 51.62,57.05 53.45,58.88 54.87,58.88 55.88,57.86 55.88,56.84 56.7,56.03 58.73,56.03 59.75,55.02 59.75,54 63.81,49.94 63.81,48.31 BAT3.NEG
N$2  (via drill 0.38)
  Top 0.203: v69.09,67.21 64.01,67.21 BAT2.NEG
  Bottom 0.203: v69.09,67.21 77.42,67.21 BAT1.POS
N$3  (via drill 0.38)
  Top 0.203: v39.63,58.47 38,56.84 23.58,56.84 15.04,48.31 11.59,48.31 BAT3.POS | v54.06,72.9 71.94,72.9 v72.75,73.71 | v109.33,68.58 129.65,48.26 BAT4.NEG
  Bottom 0.203: v54.06,72.9 v39.63,58.47 | v72.75,73.71 72.75,73.3 77.22,68.83 109.07,68.83 v109.33,68.58
N$4
  Bottom 0.203: BAT5.NEG 121.92,29.21 91.44,59.69 87.58,59.69 85.35,57.45 85.35,52.98 85.15,52.78 85.15,51.77 84.13,50.75 80.07,50.75 BAT4.POS
N$5
  Bottom 0.203: BAT6.NEG 65.64,29.21 66.25,28.6 76.81,28.6 77.42,29.21 BAT5.POS
N$6  (via drill 0.38)
  Top 0.203: v60.76,7.06 55.28,7.06 33.13,29.21 BAT6.POS
  Bottom 0.203: v60.76,7.06 63.81,10.11 BAT7.NEG
N$7  (via drill 0.38)
  Top 0.203: v65.84,3.81 57.92,3.81 51.62,10.11 11.59,10.11 BAT7.POS | v74.58,3.81 92.05,3.81 98.35,10.11 129.85,10.11 BAT8.NEG
  Bottom 0.203: v74.58,3.81 v65.84,3.81
SCL  (via drill 0.38)
  Top 0.203: v133.71,3.4 109.94,3.4 108.11,1.57 107.29,1.57 J12.4 | J7.14 J5.14 | R2.1 70.52,45.26 69.91,45.26 68.08,47.09 68.08,57.05 61.78,63.35 J14.2 | J9.4 1.63,39.17 4.88,35.92 5.29,35.92 5.9,36.53 5.9,38.56 23.78,56.44 41.25,56.44 43.9,59.08 43.9,61.72 | 43.9,61.72 43.9,64.16 32.92,75.13 32.92,75.95 J13.4 | 43.9,61.72 v45.12,61.72 | v110.75,35.31 v136.15,35.31
  Bottom 0.203: v133.71,3.4 134.73,4.42 134.73,8.89 136.35,10.52 136.35,24.74 137.98,26.36 137.98,30.84 136.96,31.85 136.96,35.31 | 136.96,35.31 136.96,36.12 138.18,37.34 J10.4 | R2.1 70.72,45.26 71.53,46.08 77.42,46.08 79.46,48.11 84.33,48.11 85.55,49.33 85.55,52.58 87.18,54.2 87.18,54.61 J7.14 91.44,54.61 v110.75,35.31 | v45.12,61.72 46.54,63.14 55.48,63.14 57.1,64.77 59.75,64.77 60.96,63.55 61.57,63.55 J14.2 | v136.15,35.31 136.96,35.31
SCL_5V  (via drill 0.38)
  Top 0.203: J21.6 50.2,48.31 52.02,50.14 52.02,56.84 53.65,58.47 59.14,58.47 59.95,57.66 59.95,48.51 65.23,43.23 70.11,43.23 71.73,44.86 71.73,45.47 71.12,46.08 70.92,46.08 69.5,47.5 JP2.2 69.5,47.7 73.16,51.36 73.16,64.16 66.45,70.87 v61.57,70.87
  Bottom 0.203: v61.57,70.87 61.57,76.15 J11.9
SDA  (via drill 0.38)
  Top 0.203: J7.11 86.97,47.09 83.32,47.09 J5.11 | v46.74,52.98 48.37,54.61 50.8,54.61 51.62,55.42 51.62,57.05 53.45,58.88 59.34,58.88 60.36,57.86 60.36,48.72 65.44,43.64 65.84,43.64 67.26,45.06 67.87,45.06 R1.1 | v92.66,45.47 v123.14,45.47 | J13.3 30.27,69.53 v29.95,69.22
  Bottom 0.203: 133.51,35.1 133.51,26.36 134.73,25.15 134.73,19.66 134.12,19.05 127.82,19.05 110.14,1.37 109.73,1.37 J12.3 | 133.51,35.1 138.38,39.98 J10.3 | J5.11 83.11,46.89 80.27,44.04 70.11,44.04 69.09,45.06 68.08,45.06 R1.1 67.87,45.26 67.26,45.26 65.44,47.09 65.44,49.53 64.42,50.55 64.42,63.35 J14.3 | 30.08,60.71 6.91,37.54 1.43,37.54 J9.3 | v46.74,52.98 37.8,52.98 30.08,60.71 | v123.14,45.47 133.51,35.1 | v92.66,45.47 91.24,46.89 86.97,46.89 J7.11 | v29.95,69.22 29.95,60.83 30.08,60.71
SDA_5V  (via drill 0.38)
  Top 0.203: v65.84,41.61 71.12,41.61 75.8,46.28 75.8,48.11 74.99,48.92 73.16,48.92 JP2.3 | v55.88,73.71 v62.39,73.71
  Bottom 0.203: 50.4,51.77 50.4,50.95 J21.5 | 50.4,51.77 52.63,54 52.63,57.45 53.65,58.47 54.67,58.47 55.48,57.66 55.48,52.17 56.9,50.75 58.93,50.75 64.83,44.86 64.83,42.62 v65.84,41.61 | v62.39,73.71 64.22,75.54 64.22,76.15 J11.8 | v55.88,73.71 46.13,63.96 45.72,63.96 41.86,60.1 41.86,58.88 48.98,51.77 50.4,51.77
VCC  (via drill 0.38)
  Top 0.203: J12.6 102.21,1.57 103.03,1.57 106.48,5.03 133.3,5.03 J4.1 133.51,5.23 134.73,6.45 134.73,16.61 138.18,20.07 138.18,32.26 J10.6 | 56.7,60.91 59.14,63.35 J14.1 59.34,63.55 60.96,65.18 v64.83,65.18 | 56.7,60.91 55.48,59.69 49.59,59.69 38,71.27 38,75.95 J13.6 | J2.2 6.91,5.23 6.91,5.84 4.88,7.87 4.88,8.89 5.19,8.89 | R1.2 68.08,32.46 70.52,32.46 R2.2 | J5.1 83.32,21.69 86.97,21.69 J7.1 | 50.2,29.21 50.2,26.77 J22.2 50.2,26.57 50.2,24.13 J22.3 50.4,24.13 50.4,23.52 59.14,14.78 59.14,13.97 J15.10 59.34,13.97 61.57,11.74 79.05,11.74 81.28,13.97 J15.1 82.1,13.97 | v83.11,19.05 83.11,18.03 82.1,17.02 82.1,13.97 | 5.19,8.89 7.73,8.89 8.34,9.5 8.34,18.44 7.73,19.05 6.51,19.05 5.69,19.86 5.69,24.94 10.37,29.62 10.37,30.02 10.77,30.43 47.35,30.43 48.57,29.21 50.2,29.21 | 50.2,29.21 J22.1 | v57.92,59.69 56.7,60.91 | v86.36,12.95 85.55,12.95 84.54,13.97 82.1,13.97 | 5.19,8.89 3.95,10.13 3.92,10.27 3.92,23.5 1.38,26.04 1.38,29.21 6.71,34.54 v6.71,38.35
  Bottom 0.203: v64.83,65.18 79.66,65.18 81.28,63.55 81.89,63.55 J14.10 | v6.71,38.35 6.71,39.98 1.63,45.06 J9.6 | R2.2 70.72,32.26 71.73,32.26 72.75,31.24 79.05,31.24 82.5,27.79 84.33,27.79 85.55,26.57 85.55,23.11 86.97,21.69 J7.1 | v83.11,19.05 83.11,21.49 J5.1 | v57.92,59.69 64.01,53.59 64.01,50.34 65.03,49.33 65.03,46.08 67.87,43.23 67.87,32.46 R1.2 | v86.36,12.95 90.63,12.95 102.01,1.57 J12.6

### Text on the board
tPlace: SDA / (3V) | SCL / (3V) | GND | 3.3V | VB | GND | Logic Level Converter | VA | OE | D19 | (RX0) D3 | (TX0) D1 | Smartcar / Modules board rev.2 / designed by Dimitris Platis / http://plat.is/smartcar | 5V | IN (BAT) | D23 | SDA | SCL | 5V | SCL | SDA | GND | 3.3V | GND | SCL / (3V) | SDA / (3V) | DO NOT USE THESE PINS WITH 5V | DO NOT USE THESE PINS WITH 5V | GND | GND | SDA / (3V) | SCL / (3V) | GND | 3.3V | GY-50 | D18 | SDO | 3V | D5 | ESP32 DOIT DEVKIT / V.1 - 30 GPIO | D17 (TX2) | D33 | D16 (RX2) | D32 | D4 (ADC) | (ADC) D15 | D2 (ADC) | ←USB | ←USB | ←USB | ←USB | ←USB | OE | VA | Logic Level Converter | 3.3V | GND | SCL / (3V) | SDA / (3V) | GND | VB